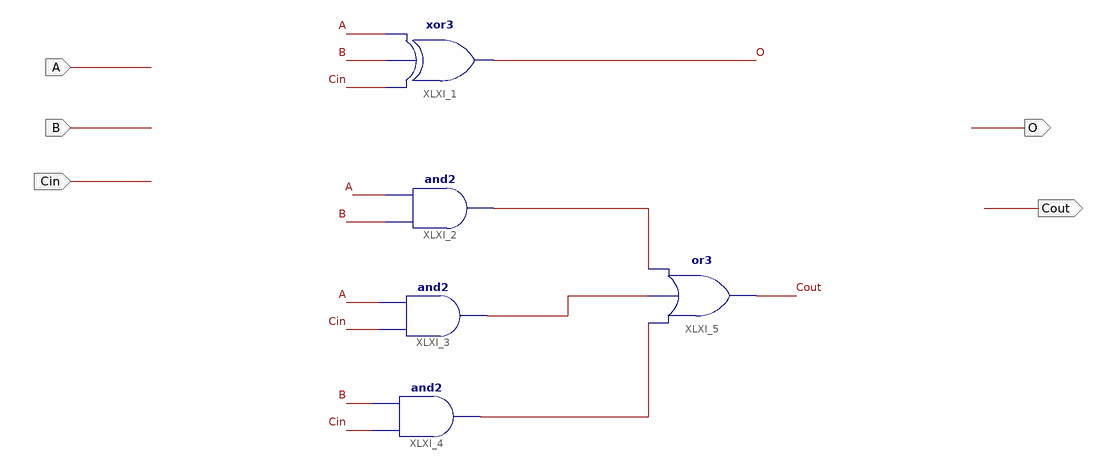
[diagram p0: schematic sheet 1]
// Xilinx ISE schematic add1b.sch (spartan6) as structural Verilog: 5 symbols, 5 ports
module add1b (
  input  A,
  input  B,
  input  Cin,
  output O,
  output Cout
);

  wire XLXN_13, XLXN_14, XLXN_15;

  xor XLXI_1 (O, Cin, B, A);
  and XLXI_2 (XLXN_13, B, A);
  and XLXI_3 (XLXN_14, Cin, A);
  and XLXI_4 (XLXN_15, Cin, B);
  or XLXI_5 (Cout, XLXN_15, XLXN_14, XLXN_13);
endmodule
